# Altium schematic sheet TS100C.SchDoc
size A3; SheetNumber: 1; SheetTotal: 1
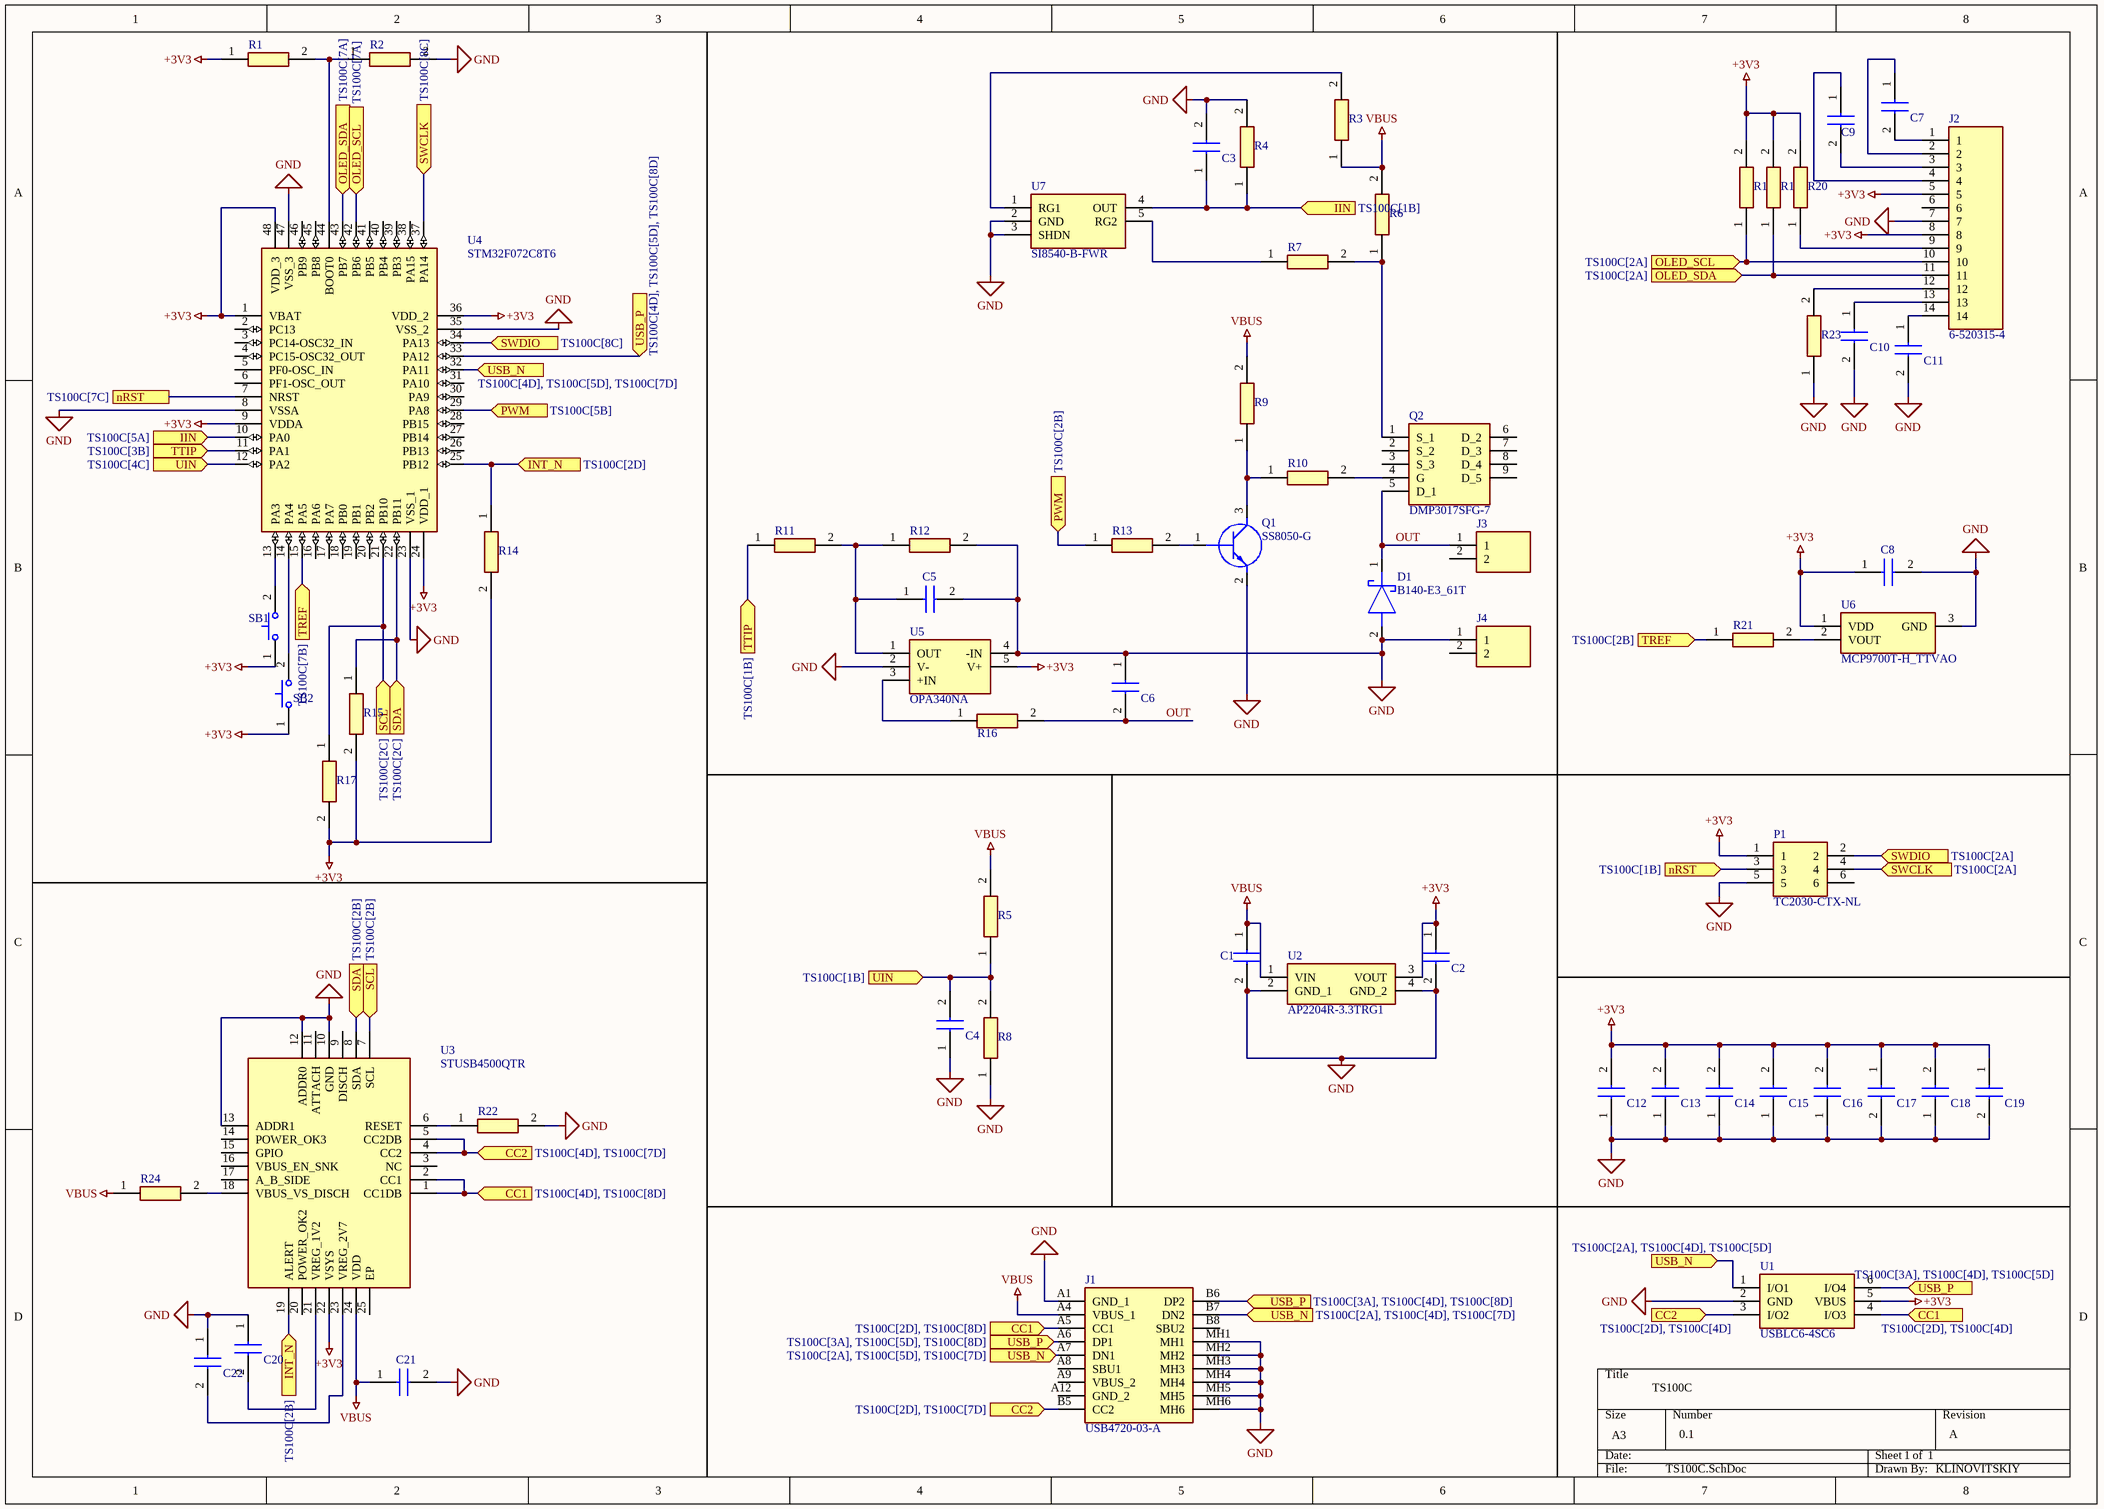
[diagram p0: TS100C.SchDoc]

## Parts
C1  MAJCT168BB7105KTEA01  [MAJx16]  (value not drawn)
C2  MAJCT168BB7105KTEA01  [MAJx16]  (value not drawn)
C3  MAASU21GSB7104MTCA01  [CAPC2012X135N]  (value not drawn)
C4  MAASU21GSB7104MTCA01  [CAPC2012X135N]  (value not drawn)
C5  C0805C180JAGACTU  [C0805]  (value not drawn)
C6  C0805C180JAGACTU  [C0805]  (value not drawn)
C7  MAJCT168BB7105KTEA01  [MAJx16]  (value not drawn)
C8  MAASU21GSB7104MTCA01  [CAPC2012X135N]  (value not drawn)
C9  MAJCT168BB7105KTEA01  [MAJx16]  (value not drawn)
C10  MAJCT168BB7105KTEA01  [MAJx16]  (value not drawn)
C11  MAJCT168BB7105KTEA01  [MAJx16]  (value not drawn)
C12  MAASU21GSB7104MTCA01  [CAPC2012X135N]  (value not drawn)
C13  MAASU21GSB7104MTCA01  [CAPC2012X135N]  (value not drawn)
C14  MAASU21GSB7104MTCA01  [CAPC2012X135N]  (value not drawn)
C15  MAASU21GSB7104MTCA01  [CAPC2012X135N]  (value not drawn)
C16  MAASU21GSB7104MTCA01  [CAPC2012X135N]  (value not drawn)
C17  MAJCT168BB7105KTEA01  [MAJx16]  (value not drawn)
C18  MAASU21GSB7104MTCA01  [CAPC2012X135N]  (value not drawn)
C19  MAJCT168BB7105KTEA01  [MAJx16]  (value not drawn)
C20  MAJCT168BB7105KTEA01  [MAJx16]  (value not drawn)
C21  MAASU21GSB7104MTCA01  [CAPC2012X135N]  (value not drawn)
C22  MAJCT168BB7105KTEA01  [MAJx16]  (value not drawn)
D1  B140-E3_61T  [DIOM5127X229N]
J1  USB4720-03-A  [USB472003A]
J2  6-520315-4  [65203154]
J3  1-770166-0  [17701660]  (value not drawn)
J4  1-770166-0  [17701660]  (value not drawn)
P1  TC2030-CTX-NL  [TC2030MCPNL10]
Q1  SS8050-G  [SOT95P240X115-3N]
Q2  DMP3017SFG-7  [DMP3007SFG7]
R1  WSL080500000ZEA9  [RESC2013X84N]  (value not drawn)
R2  RN73C2A2K37BTG  [RESC2012X65N]  (value not drawn)
R3  SMQW133RJT  [RESM7940X385N]  (value not drawn)
R4  RN73C2A2K37BTG  [RESC2012X65N]  (value not drawn)
R5  CRCW0805560KJNEAHP  [RESC2012X60N]  (value not drawn)
R6  WSLP0805R0100DEA  [RESC2013X58N]  (value not drawn)
R7  SMQW133RJT  [RESM7940X385N]  (value not drawn)
R8  SFR01MZPF1003  [RESC1005X40N]  (value not drawn)
R9  RN73C2A2K37BTG  [RESC2012X65N]  (value not drawn)
R10  ERJ-UP6D20R0V  [ERJUP6]  (value not drawn)
R11  RN73C2A2K37BTG  [RESC2012X65N]  (value not drawn)
R12  RCV2010750KFKEFAT  [RESC5025X70N]  (value not drawn)
R13  RN73C2A2K37BTG  [RESC2012X65N]  (value not drawn)
R14  RN73C2A2K37BTG  [RESC2012X65N]  (value not drawn)
R15  RN73C2A2K37BTG  [RESC2012X65N]  (value not drawn)
R16  SFR01MZPF1003  [RESC1005X40N]  (value not drawn)
R17  RN73C2A2K37BTG  [RESC2012X65N]  (value not drawn)
R18  RN73C2A2K37BTG  [RESC2012X65N]  (value not drawn)
R19  RN73C2A2K37BTG  [RESC2012X65N]  (value not drawn)
R20  RN73C2A2K37BTG  [RESC2012X65N]  (value not drawn)
R21  RN73C2A2K37BTG  [RESC2012X65N]  (value not drawn)
R22  RN73C2A2K37BTG  [RESC2012X65N]  (value not drawn)
R23  CRCW0805560KJNEAHP  [RESC2012X60N]  (value not drawn)
R24  RN73C2A2K37BTG  [RESC2012X65N]  (value not drawn)
SB1  8631CQD2  [8631CQD2]  (value not drawn)
SB2  8631CQD2  [8631CQD2]  (value not drawn)
U1  USBLC6-4SC6  [SOT95P280X145-6N]
U2  AP2204R-3.3TRG1  [AP2204R33TRG1]
U3  STUSB4500QTR  [QFN50P400X400X100-25N-D]
U4  STM32F072C8T6  [QFP50P900X900X160-48N]
U5  OPA340NA  [SOT95P280X145-5N]
U6  MCP9700T-H_TTVAO  [SOT95P237X112-3N]
U7  SI8540-B-FWR  [SOT95P280X145-5N]

## Ports
CC1 (in, see TS100C[2D], TS100C[4D]), CC1 (in, see TS100C[2D], TS100C[8D]), CC1 (in, see TS100C[4D], TS100C[8D]), CC2 (in, see TS100C[2D], TS100C[4D]), CC2 (in, see TS100C[2D], TS100C[7D]), CC2 (in, see TS100C[4D], TS100C[7D]), IIN (in, see TS100C[1B]), IIN (in, see TS100C[5A]), INT_N (in, see TS100C[2B]), INT_N (in, see TS100C[2D]), nRST (in, see TS100C[1B]), nRST (see TS100C[7C]), OLED_SCL (in, see TS100C[2A]), OLED_SCL (in, see TS100C[7A]), OLED_SDA (in, see TS100C[2A]), OLED_SDA (in, see TS100C[7A]), PWM (in, see TS100C[2B]), PWM (in, see TS100C[5B]), SCL (in, see TS100C[2B]), SCL (in, see TS100C[2C]), SDA (in, see TS100C[2B]), SDA (in, see TS100C[2C]), SWCLK (in, see TS100C[2A]), SWCLK (in, see TS100C[8C]), SWDIO (in, see TS100C[2A]), SWDIO (in, see TS100C[8C]), TREF (in, see TS100C[2B]), TREF (in, see TS100C[7B]), TTIP (in, see TS100C[1B]), TTIP (in, see TS100C[3B]), UIN (in, see TS100C[1B]), UIN (in, see TS100C[4C]), USB_N (in, see TS100C[2A], TS100C[4D], TS100C[5D]), USB_N (in, see TS100C[2A], TS100C[4D], TS100C[7D]), USB_N (in, see TS100C[2A], TS100C[5D], TS100C[7D]), USB_N (in, see TS100C[4D], TS100C[5D], TS100C[7D]), USB_P (in, see TS100C[3A], TS100C[4D], TS100C[5D]), USB_P (in, see TS100C[3A], TS100C[4D], TS100C[8D]), USB_P (in, see TS100C[3A], TS100C[5D], TS100C[8D]), USB_P (in, see TS100C[4D], TS100C[5D], TS100C[8D])

## Nets
+3V3: C2.1 C8.1 C12.2 C13.2 C14.2 C15.2 C16.2 C17.1 C18.2 C19.1 J2.5 J2.8 P1.1 R1.1 R14.2 R15.2 R17.2 R18.2 R19.2 R20.2 SB1.1(N.O._1) SB2.1(N.O._1) U1.5(VBUS) U2.3(VOUT) U3.22(VSYS) U4.1(VBAT) U4.9(VDDA) U4.24(VDD_1) U4.36(VDD_2) U4.48(VDD_3) U5.5(V+) U6.1(VDD)
GND: C1.2 C2.2 C3.2 C4.1 C5.2 C6.1 C8.2 C10.2 C11.2 C12.1 C13.1 C14.1 C15.1 C16.1 C17.2 C18.1 C19.2 C20.1 C21.2 C22.1 D1.2(A) J1.A1(GND_1) J1.MH1 J1.MH2 J1.MH3 J1.MH4 J1.MH5 J1.MH6 J2.7 J4.1 P1.5 Q1.2(E) R2.2 R4.2 R8.1 R12.2 R22.2 R23.1 U1.2(GND) U2.2(GND_1) U2.4(GND_2) U3.10(GND) U3.12(ADDR0) U3.13(ADDR1) U4.8(VSSA) U4.23(VSS_1) U4.35(VSS_2) U4.47(VSS_3) U5.2(V-) U5.4(-IN) U6.3(GND) U7.2(GND) U7.3(SHDN)
VBUS: C1.1 C21.1 J1.A4(VBUS_1) R3.1 R5.2 R6.2 R9.2 R24.1 U2.1(VIN) U3.24(VDD)
CC1: J1.A5(CC1) U1.4(I/O3) U3.1(CC1DB) U3.2(CC1) ; port CC1
CC2: J1.B5(CC2) U1.3(I/O2) U3.4(CC2) U3.5(CC2DB) ; port CC2
IIN: C3.1 R4.1 U4.10(PA0) U7.4(OUT) ; port IIN
INT_N: R14.1 U3.19(ALERT) U4.25(PB12) ; port INT_N
nRST: P1.3 U4.7(NRST) ; port nRST
OLED_SCL: J2.10 R18.1 U4.42(PB6) ; port OLED_SCL
OLED_SDA: J2.11 R19.1 U4.43(PB7) ; port OLED_SDA
OUT: C6.2 D1.1(K) J3.1 Q2.5(D_1) R16.2
PWM: R13.1 U4.29(PA8) ; port PWM
SCL: R17.1 U3.7(SCL) U4.21(PB10) ; port SCL
SDA: R15.1 U3.8(SDA) U4.22(PB11) ; port SDA
SWCLK: P1.4 U4.37(PA14) ; port SWCLK
SWDIO: P1.2 U4.34(PA13) ; port SWDIO
TREF: R21.1 U4.15(PA5) ; port TREF
TTIP: R11.1 U4.11(PA1) ; port TTIP
UIN: C4.2 R5.1 R8.2 U4.12(PA2) ; port UIN
USB_N: J1.A7(DN1) J1.B7(DN2) U1.1(I/O1) U4.32(PA11) ; port USB_N
USB_P: J1.A6(DP1) J1.B6(DP2) U1.6(I/O4) U4.33(PA12) ; port USB_P
NetC5_1: C5.1 R11.2 R12.1 U5.1(OUT)
NetC7_1: C7.1 J2.2
NetC7_2: C7.2 J2.1
NetC9_1: C9.1 J2.4
NetC9_2: C9.2 J2.3
NetC10_1: C10.1 J2.13
NetC11_1: C11.1 J2.14
NetC20_2: C20.2 U3.21(VREG_1V2)
NetC22_2: C22.2 U3.23(VREG_2V7)
NetJ2_9: J2.9 R20.1
NetJ2_12: J2.12 R23.2
NetQ1_1: Q1.1(B) R13.2
NetQ1_3: Q1.3(C) R9.1 R10.1
NetQ2_1: Q2.1(S_1) R6.1 R7.2
NetQ2_4: Q2.4(G) R10.2
NetR1_2: R1.2 R2.1 U4.44(BOOT0)
NetR3_2: R3.2 U7.1(RG1)
NetR7_1: R7.1 U7.5(RG2)
NetR16_1: R16.1 U5.3(+IN)
NetR21_2: R21.2 U6.2(VOUT)
NetR22_1: R22.1 U3.6(RESET)
NetR24_2: R24.2 U3.18(VBUS_VS_DISCH)
NetSB1_2: SB1.2(N.O._2) U4.13(PA3)
NetSB2_2: SB2.2(N.O._2) U4.14(PA4)

Not connected (* = marked no-connect by the designer): J1 A8(SBU1) A9(VBUS_2) A12(GND_2) B8(SBU2); J2 6; J3 2; J4 2; P1 6; Q2 2(S_2) 3(S_3) 6(D_2) 7(D_3) 8(D_4) 9(D_5); U3 3(NC) 9(DISCH) 11(ATTACH) 14(POWER_OK3) 15(GPIO) 16(VBUS_EN_SNK) 17(A_B_SIDE) 20(POWER_OK2) 25(EP); U4 2(PC13) 3(PC14-OSC32_IN) 4(PC15-OSC32_OUT) 5(PF0-OSC_IN) 6(PF1-OSC_OUT) 16(PA6) 17(PA7) 18(PB0) 19(PB1) 20(PB2) 26(PB13) 27(PB14) 28(PB15) 30(PA9) 31(PA10) 38(PA15) 39(PB3) 40(PB4) 41(PB5) 45(PB8) 46(PB9)

## Notes on the sheet
- TS100C
- 0.1
- 1
- A
- KLINOVITSKIY

## Library data of the parts
C1 C2 C7 C9-C11 C17 C19 C20 C22 = MAJCT168BB7105KTEA01: Capacitor; Manufacturer_Name: TAIYO YUDEN; Datasheet Link: https://ds.yuden.co.jp/TYCOMPAS/or/detail?pn=MAJCT168BB7105KTEA01; Height: 0.8mm; Manufacturer_Part_Number: MAJCT168BB7105KTEA01
C3 C4 C8 C12-C16 C18 C21 = MAASU21GSB7104MTCA01: Capacitor; Manufacturer_Name: TAIYO YUDEN; Datasheet Link: https://ds.yuden.co.jp/TYCOMPAS/ap/detail?pn=MAASU21GSB7104MTCA01&u=M; Height: 1.35mm; Manufacturer_Part_Number: MAASU21GSB7104MTCA01; Mouser Part Number: 963-MAASU21GSB7104M; Mouser Price/Stock: https://www.mouser.co.uk/ProductDetail/TAIYO-YUDEN/MAASU21GSB7104MTCA01?qs=HFfMDpzxxd3%252BHMM46uQdgg%3D%3D
C5 C6 = C0805C180JAGACTU: Capacitor; Manufacturer_Name: KEMET; Datasheet Link: https://content.kemet.com/datasheets/KEM_C1003_C0G_SMD.pdf; Height: 1.1mm; Manufacturer_Part_Number: C0805C180JAGACTU; Mouser Part Number: 80-C0805C180JAGACTU; Mouser Price/Stock: https://www.mouser.co.uk/ProductDetail/KEMET/C0805C180JAGACTU?qs=rrS6PyfT74e3xQakzGupuw%3D%3D
D1 = B140-E3_61T: Schottky Diode; Manufacturer_Name: Vishay; Manufacturer_Part_Number: B140-E3/61T; Datasheet Link: https://componentsearchengine.com/Datasheets/2/B140-E3_61T.pdf; Height: 2.29mm; Mouser Part Number: 625-B140-E3/61T; Mouser Price/Stock: https://www.mouser.co.uk/ProductDetail/Vishay-General-Semiconductor/B140-E3-61T?qs=tdXsjSi%2FIMY8eBFzBOcYwA%3D%3D; Arrow Part Number: B140-E3/61T; Arrow Price/Stock: https://www.arrow.com/en/products/b140-e361t/vishay?region=nac
J1 = USB4720-03-A: Connector; Manufacturer_Name: GCT (GLOBAL CONNECTOR TECHNOLOGY); Datasheet Link: https://www.gct.co/files/drawings/USB4720.pdf; Height: 3.9mm; Manufacturer_Part_Number: USB4720-03-A; Mouser Part Number: 640-USB472003A; Mouser Price/Stock: https://www.mouser.co.uk/ProductDetail/GCT/USB4720-03-A?qs=Z%252BL2brAPG1IK%252BbxHmYg8zQ%3D%3D
J2 = 6-520315-4: Connector; Manufacturer_Name: TE Connectivity; Datasheet Link: https://www.te.com/commerce/DocumentDelivery/DDEController?Action=srchrtrv&DocNm=520315&DocType=Customer+Drawing&DocLang=English; Height: 6.93mm; Manufacturer_Part_Number: 6-520315-4; Mouser Part Number: 571-6-520315-4; Mouser Price/Stock: https://www.mouser.co.uk/ProductDetail/TE-Connectivity/6-520315-4/?qs=lnVw2K6okukqGNss6X1ebA%3D%3D; Arrow Part Number: 6-520315-4; Arrow Price/Stock: https://www.arrow.com/en/products/6-520315-4/te-connectivity
J3 J4 = 1-770166-0: Connector; Manufacturer_Name: TE Connectivity; Datasheet Link: https://www.te.com/commerce/DocumentDelivery/DDEController?Action=showdoc&DocId=Customer+Drawing%7F770166%7FM%7Fpdf%7FEnglish%7FENG_CD_770166_M.pdf%7F1-770166-0; Height: 14.25mm; Manufacturer_Part_Number: 1-770166-0; Mouser Part Number: 571-1-770166-0; Mouser Price/Stock: https://www.mouser.co.uk/ProductDetail/TE-Connectivity-AMP/1-770166-0?qs=m8myXnDJXpW%252BZqFFniy0cw%3D%3D; Arrow Part Number: 1-770166-0; Arrow Price/Stock: https://www.arrow.com/en/products/1-770166-0/te-connectivity?region=europe
P1 = TC2030-CTX-NL: Connector; Manufacturer_Name: Tag Connect; Height: 18mm; Manufacturer_Part_Number: TC2030-CTX-NL
Q1 = SS8050-G: Transistor BJT NPN; Manufacturer_Name: Comchip Technology; Datasheet Link: https://datasheet.datasheetarchive.com/originals/distributors/DKDS-12/229454.pdf; Height: 1.15mm; Manufacturer_Part_Number: SS8050-G; Mouser Part Number: 750-SS8050-G; Mouser Price/Stock: https://www.mouser.co.uk/ProductDetail/Comchip-Technology/SS8050-G?qs=LLUE9lz1YbcHg%252BWLMAtcrQ%3D%3D; Arrow Part Number: SS8050-G; Arrow Price/Stock: https://www.arrow.com/en/products/ss8050-g/comchip-technology?region=nac
Q2 = DMP3017SFG-7: MOSFET (P-Channel); Manufacturer_Name: Diodes Incorporated; Datasheet Link: https://www.diodes.com/assets/Datasheets/products_inactive_data/DMP3017SFG.pdf; Height: 0.8mm; Manufacturer_Part_Number: DMP3017SFG-7; Mouser Part Number: 621-DMP3017SFG-7; Mouser Price/Stock: https://www.mouser.co.uk/ProductDetail/Diodes-Incorporated/DMP3017SFG-7?qs=dOK1vf2izjuHbyAr8sMEAg%3D%3D; Arrow Part Number: DMP3017SFG-7; Arrow Price/Stock: https://www.arrow.com/en/products/dmp3017sfg-7/diodes-incorporated
R1 = WSL080500000ZEA9: Resistor; Manufacturer_Name: Vishay; Datasheet Link: https://ad.componentsearchengine.com/Datasheets/2/WSL080500000ZEA9.pdf; Height: 0.838mm; Manufacturer_Part_Number: WSL080500000ZEA9; Mouser Part Number: 71-WSL080500000ZEA9; Mouser Price/Stock: https://www.mouser.co.uk/ProductDetail/Vishay-Dale/WSL080500000ZEA9?qs=f1l5vAGoKgsImKS87N8TmQ%3D%3D; Arrow Part Number: WSL080500000ZEA9; Arrow Price/Stock: https://www.arrow.com/en/products/wsl080500000zea9/vishay?region=nac
R2 R4 R9 R11 R13-R15 R17-R22 R24 = RN73C2A2K37BTG: Resistor; Manufacturer_Name: TE Connectivity; Datasheet Link: http://docs-europe.electrocomponents.com/webdocs/1488/0900766b814885e5.pdf; Height: 0.65mm; Manufacturer_Part_Number: RN73C2A2K37BTG
R3 R7 = SMQW133RJT: Resistor; Manufacturer_Name: TE Connectivity; Datasheet Link: https://www.mouser.com/datasheet/2/418/9/ENG_DS_1773242_2_A2-3315018.pdf; Height: 3.85mm; Manufacturer_Part_Number: SMQW133RJT
R5 R23 = CRCW0805560KJNEAHP: Resistor; Manufacturer_Name: Vishay; Datasheet Link: https://componentsearchengine.com/Datasheets/1/CRCW08051R00FKEAHP.pdf; Height: 0.6mm; Manufacturer_Part_Number: CRCW0805560KJNEAHP; Mouser Part Number: 71-CRCW0805560KJNEAH; Mouser Price/Stock: https://www.mouser.co.uk/ProductDetail/Vishay-Dale/CRCW0805560KJNEAHP?qs=0aKCkHzzSeQDG3izC1p2kA%3D%3D
R6 = WSLP0805R0100DEA: Resistor; Manufacturer_Name: Vishay; Datasheet Link: https://componentsearchengine.com/Datasheets/1/WSLP0805R0100DEA.pdf; Height: 0.584mm; Manufacturer_Part_Number: WSLP0805R0100DEA; Mouser Part Number: 71-WSLP0805R0100DEA; Mouser Price/Stock: https://www.mouser.co.uk/ProductDetail/Vishay-Dale/WSLP0805R0100DEA?qs=l%252BoLuM8chxox98xrLk2FIg%3D%3D
R8 R16 = SFR01MZPF1003: Resistor; Manufacturer_Name: ROHM Semiconductor; Datasheet Link: https://fscdn.rohm.com/en/products/databook/datasheet/passive/resistor/chip_resistor/sfr-e.pdf; Height: 0.4mm; Manufacturer_Part_Number: SFR01MZPF1003; Mouser Part Number: 755-SFR01MZPF1003; Mouser Price/Stock: https://www.mouser.co.uk/ProductDetail/ROHM-Semiconductor/SFR01MZPF1003?qs=Mv7BduZupUj2RFL5gMaKTg%3D%3D
R10 = ERJ-UP6D20R0V: Resistor; Manufacturer_Name: Panasonic; Datasheet Link: https://industrial.panasonic.com/cdbs/www-data/pdf/RDP0000/AOA0000C337.pdf; Height: 0.7mm; Manufacturer_Part_Number: ERJ-UP6D20R0V
R12 = RCV2010750KFKEFAT: Resistor; Manufacturer_Name: Vishay; Datasheet Link: https://www.vishay.com/docs/20082/rcvat-e3.pdf; Height: 0.7mm; Manufacturer_Part_Number: RCV2010750KFKEFAT; Mouser Part Number: 71-RCV2010750KFKEFAT; Mouser Price/Stock: https://www.mouser.co.uk/ProductDetail/Vishay-Draloric/RCV2010750KFKEFAT?qs=hWgE7mdIu5SyrxPUQqiMpQ%3D%3D
SB1 SB2 = 8631CQD2: Switch (2-Pin Push); Manufacturer_Name: C & K COMPONENTS; Datasheet Link: https://www.ckswitches.com/media/1396/8600.pdf; Height: 13.93mm; Manufacturer_Part_Number: 8631CQD2; Mouser Part Number: 611-8631-261; Mouser Price/Stock: https://www.mouser.co.uk/ProductDetail/CK/8631CQD2?qs=ktcBc77oICXe9iPhfEwnkA%3D%3D
U1 = USBLC6-4SC6: Integrated Circuit; Manufacturer_Name: STMicroelectronics; Datasheet Link: http://www.st.com/st-web-ui/static/active/en/resource/technical/document/datasheet/CD00047494.pdf; Height: 1.45mm; Manufacturer_Part_Number: USBLC6-4SC6; Mouser Part Number: 511-USBLC6-4SC6; Mouser Price/Stock: https://www.mouser.co.uk/ProductDetail/STMicroelectronics/USBLC6-4SC6?qs=k9dH%2Fx4GHJCNdehb8zInZg%3D%3D; Arrow Part Number: USBLC6-4SC6; Arrow Price/Stock: https://www.arrow.com/en/products/usblc6-4sc6/stmicroelectronics?region=nac
U2 = AP2204R-3.3TRG1: Integrated Circuit; Manufacturer_Name: Diodes Incorporated; Datasheet Link: https://datasheet.datasheetarchive.com/originals/distributors/Datasheets_SAMA/5d52b656135dbfe7dbe35c76df69cd37.pdf; Height: 3mm; Manufacturer_Part_Number: AP2204R-3.3TRG1; Mouser Part Number: 621-AP2204R-3.3TRG1; Mouser Price/Stock: https://www.mouser.co.uk/ProductDetail/Diodes-Incorporated/AP2204R-3.3TRG1?qs=x6A8l6qLYDBeOWjkU%252BFKYw%3D%3D; Arrow Part Number: AP2204R-3.3TRG1; Arrow Price/Stock: https://www.arrow.com/en/products/ap2204r-3.3trg1/diodes-incorporated?region=nac
U3 = STUSB4500QTR: Integrated Circuit; Manufacturer_Name: STMicroelectronics; Datasheet Link: https://www.st.com/resource/en/datasheet/stusb4500.pdf; Height: 1mm; Manufacturer_Part_Number: STUSB4500QTR; Mouser Part Number: 511-STUSB4500QTR; Mouser Price/Stock: https://www.mouser.co.uk/ProductDetail/STMicroelectronics/STUSB4500QTR?qs=wUXugUrL1qyQbYMSzG1ujg%3D%3D; Arrow Part Number: STUSB4500QTR; Arrow Price/Stock: https://www.arrow.com/en/products/stusb4500qtr/stmicroelectronics?region=europe
U4 = STM32F072C8T6: Integrated Circuit; Manufacturer_Name: STMicroelectronics; Datasheet Link: https://componentsearchengine.com/Datasheets/2/STM32F072C8T6.pdf; Height: 1.6mm; Manufacturer_Part_Number: STM32F072C8T6; Mouser Part Number: 511-STM32F072C8T6; Mouser Price/Stock: https://www.mouser.co.uk/ProductDetail/STMicroelectronics/STM32F072C8T6?qs=4b8myOmUP%252BsnybMOCvNZeA%3D%3D; Arrow Part Number: STM32F072C8T6; Arrow Price/Stock: https://www.arrow.com/en/products/stm32f072c8t6/stmicroelectronics?region=europe
U5 = OPA340NA: Integrated Circuit; Manufacturer_Name: Texas Instruments; Datasheet Link: https://www.ti.com/lit/ds/symlink/opa4340.pdf?hkey=EF798316E3902B6ED9A73243A3159BB0; Height: 1.45mm; Manufacturer_Part_Number: OPA340NA
U6 = MCP9700T-H_TTVAO: Integrated Circuit; Manufacturer_Name: Microchip; Manufacturer_Part_Number: MCP9700T-H/TTVAO; Datasheet Link: https://www.mouser.com/datasheet/2/268/20001942G-1820450.pdf; Height: 1.12mm; Mouser Part Number: 579-MCP9700T-H/TTVAO; Mouser Price/Stock: https://www.mouser.co.uk/ProductDetail/Microchip-Technology/MCP9700T-H-TTVAO?qs=5aG0NVq1C4zDcteb3AGtGQ%3D%3D; Arrow Part Number: MCP9700T-H/TTVAO; Arrow Price/Stock: https://www.arrow.com/en/products/mcp9700t-httvao/microchip-technology?region=nac
U7 = SI8540-B-FWR: Integrated Circuit; Manufacturer_Name: Silicon Labs; Datasheet Link: https://www.silabs.com/documents/public/data-sheets/Si8540.pdf; Height: 1.45mm; Manufacturer_Part_Number: SI8540-B-FWR; Mouser Part Number: 634-SI8540-B-FWR; Mouser Price/Stock: https://www.mouser.co.uk/ProductDetail/Silicon-Labs/SI8540-B-FWR?qs=DPMK3kMt%252Bod456L9OnEl5Q%3D%3D; Arrow Part Number: SI8540-B-FWR; Arrow Price/Stock: https://www.arrow.com/en/products/si8540-b-fwr/silicon-labs